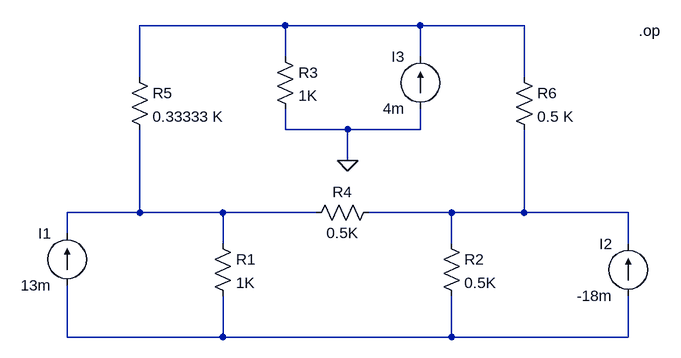
[diagram p0: schematic guia_1A_ej_21.asc]
guia_1A_ej_21.asc, the LTspice schematic file:
Version 4
SHEET 1 880 680
WIRE -720 192 -944 192
WIRE -512 192 -720 192
WIRE -352 192 -512 192
WIRE -720 240 -720 192
WIRE -512 240 -512 192
WIRE -944 272 -944 192
WIRE -352 272 -352 192
WIRE -720 352 -720 320
WIRE -624 352 -720 352
WIRE -512 352 -512 320
WIRE -512 352 -624 352
WIRE -624 400 -624 352
WIRE -944 480 -944 352
WIRE -944 480 -1056 480
WIRE -816 480 -944 480
WIRE -672 480 -816 480
WIRE -464 480 -592 480
WIRE -352 480 -352 352
WIRE -352 480 -464 480
WIRE -192 480 -352 480
WIRE -1056 512 -1056 480
WIRE -816 528 -816 480
WIRE -464 528 -464 480
WIRE -192 528 -192 480
WIRE -1056 672 -1056 592
WIRE -816 672 -816 608
WIRE -816 672 -1056 672
WIRE -464 672 -464 608
WIRE -464 672 -816 672
WIRE -192 672 -192 608
WIRE -192 672 -464 672
FLAG -624 400 0
SYMBOL res -832 512 R0
SYMATTR InstName R1
SYMATTR Value 1K
SYMBOL res -480 512 R0
SYMATTR InstName R2
SYMATTR Value 0.5K
SYMBOL res -736 224 R0
SYMATTR InstName R3
SYMATTR Value 1K
SYMBOL res -576 464 R90
WINDOW 0 0 56 VBottom 2
WINDOW 3 32 56 VTop 2
SYMATTR InstName R4
SYMATTR Value 0.5K
SYMBOL res -960 256 R0
SYMATTR InstName R5
SYMATTR Value 0.33333 K
SYMBOL res -368 256 R0
SYMATTR InstName R6
SYMATTR Value 0.5 K
SYMBOL current -1056 592 R180
WINDOW 0 24 80 Left 2
WINDOW 3 24 0 Left 2
SYMATTR InstName I1
SYMATTR Value 13m
SYMBOL current -192 608 R180
WINDOW 0 24 80 Left 2
WINDOW 3 24 0 Left 2
SYMATTR InstName I2
SYMATTR Value -18m
SYMBOL current -512 320 R180
WINDOW 0 24 80 Left 2
WINDOW 3 24 0 Left 2
SYMATTR InstName I3
SYMATTR Value 4m
TEXT -176 200 Left 2 !.op

The netlist it stands for:
* guia_1A_ej_21.asc
R1 N002 N004 1K
R2 N003 N004 0.5K
R3 N001 0 1K
R4 N003 N002 0.5K
R5 N001 N002 0.33333 K
R6 N001 N003 0.5 K
I1 N004 N002 13m
I2 N004 N003 -18m
I3 0 N001 4m
.op
.backanno
.end